# EAGLE design SwitchBox (EAGLE 5.10)
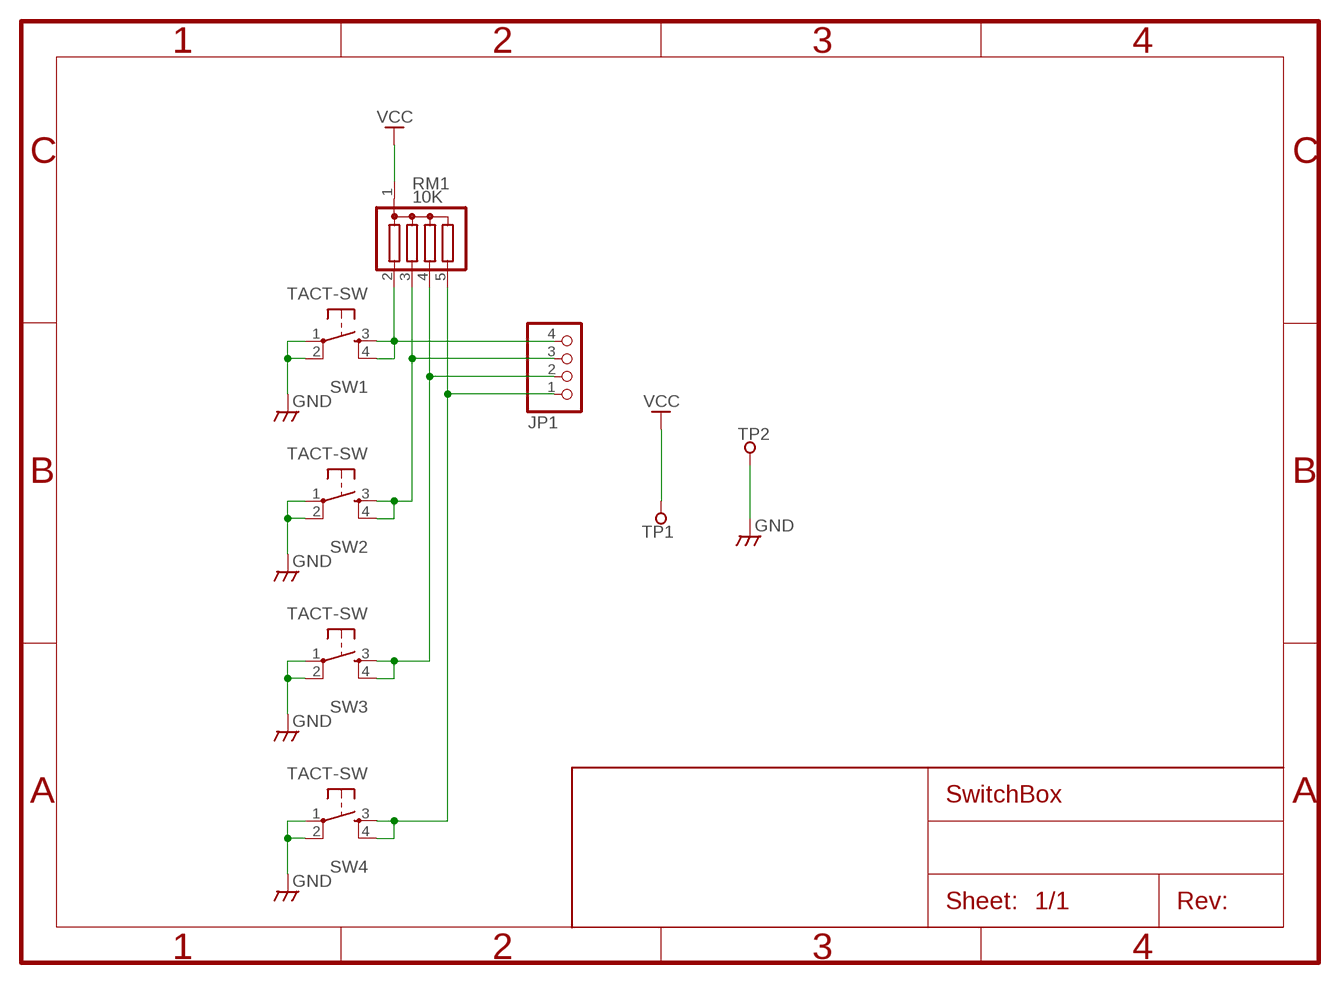
[diagram p0: schematic, sheet 1]

## Parts
JP1  PINHD-1X04_2.54-90°  [1X04/90]
RM1  10K  RM4  [SIL5]
SW1  TACT-SW  [B3F-10X]
SW2  TACT-SW  [B3F-10X]
SW3  TACT-SW  [B3F-10X]
SW4  TACT-SW  [B3F-10X]
TP1  TP1  [TP1]
TP2  TP1  [TP1]

## Nets
GND: SW1.1(P) SW1.2(P1) SW2.1(P) SW2.2(P1) SW3.1(P) SW3.2(P1) SW4.1(P) SW4.2(P1) TP2.P$1
N$1: JP1.4 RM1.2 SW1.3(S) SW1.4(S1)
N$2: JP1.3 RM1.3 SW2.3(S) SW2.4(S1)
N$3: JP1.1 RM1.5 SW4.3(S) SW4.4(S1)
N$4: JP1.2 RM1.4 SW3.3(S) SW3.4(S1)
VCC: RM1.1 TP1.P$1

## Library data of the parts
JP1 = pinheader:PINHD-1X04: PIN HEADER
RM1 = MyLib:RM4: 4 Element Register Array Module
SW1-SW4 = MyLib:TACT-SW: Tacticle Push Switch
TP1 TP2 = MyLib:TP1: 1 Pin Test Point

## Board
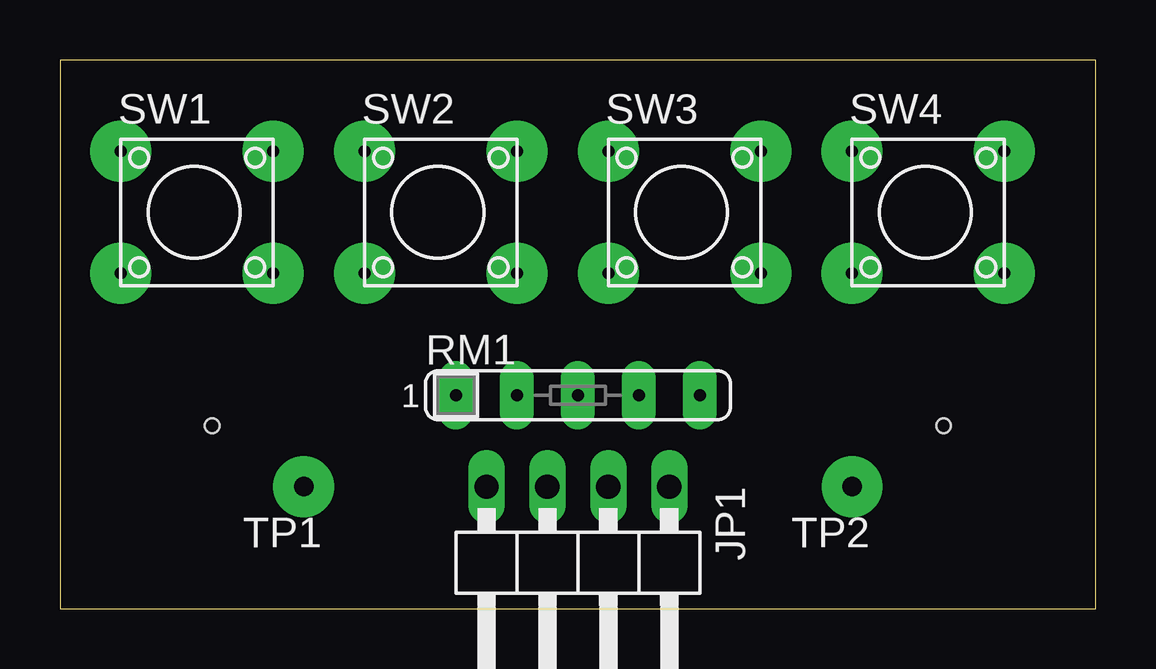
[diagram p1: board, top side]
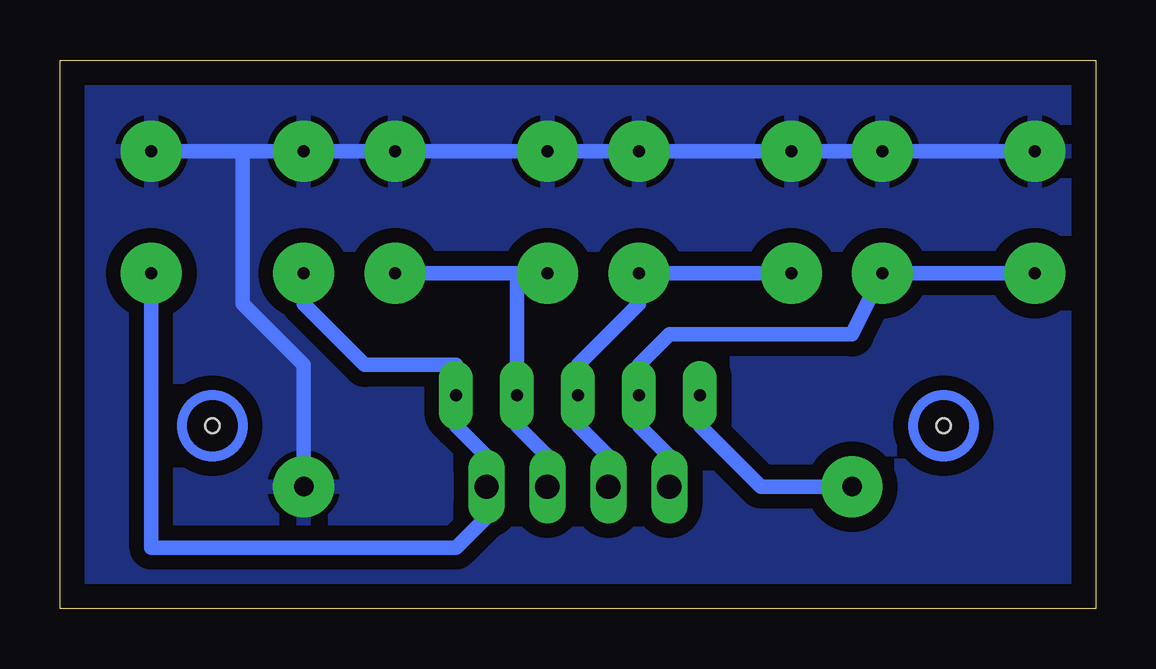
[diagram p2: board, bottom side, seen from below]

Size 43.18 x 22.86 mm. Coordinates in mm from the lower left corner, seen from the top.
Outline: 0,0 43.18,0 43.18,22.86 0,22.85 0,0
Copper layers (1*16): Top 0.035mm / dielectric 1.5mm / Bottom 0.035mm
Design rules "default": minimum track width 10mil, minimum drill 24mil, track to track 8mil, track to pad 8mil, pad to pad 8mil, via to via 8mil, smd to smd 8mil, copper to edge 40mil, drill to drill 8mil, minimum pad ring 10mil, minimum via ring 8mil, stop-mask expansion 4mil, vias tented up to drill 0mil, thermal gap 10mil
Holes 0.6 mm at 6.35,7.62 36.83,7.62

### Footprints (pad centres in the part's own frame; a part is rotated, then mirrored left to right if it is on the bottom)
1X04/90 = drill 1.016 long: 1 -3.81,-3.81; 2 -1.27,-3.81; 3 1.27,-3.81; 4 3.81,-3.81
SIL5 = drill 0.5 pad 1.422 long: 1 -5.08,0; 2 -2.54,0; 3 0,0; 4 2.54,0; 5 5.08,0
B3F-10X = drill 0.5 pad 2.54 round: 1 -1.27,2.54; 2 5.08,2.54; 3 -1.27,-2.54; 4 5.08,-2.54
TP1 = drill 0.813 pad 2.54 round: P$1 0,0

### Placement (x,y rotation side)
JP1  21.59,1.27 180 top
RM1  21.59,8.89 0 top
SW1  3.81,16.51 0 top
SW2  13.97,16.51 0 top
SW3  24.13,16.51 0 top
SW4  34.29,16.51 0 top
TP1  10.16,5.08 0 top
TP2  33.02,5.08 0 top

### Tracks (layer width: path | path; a pad name or v marks a point on that pad's centre or on a via)
GND
  Bottom 0.61: 35.56,19.05 SW4.1 SW3.2 SW2.2 | 35.56,19.05 SW4.2 | TP2.P$1 33.02,10.16 35.56,12.7 35.56,19.05 | SW1.1 SW1.2 SW2.1 SW2.2 | SW2.2 SW3.1
  pour Bottom (isolate 0.61): 0,22.86 0,0 43.18,0 43.18,22.86
N$1
  Bottom 0.61: SW1.3 SW1.4 10.16,11.43 16.51,11.43 17.78,11.43 19.05,10.16 RM1.2 19.05,7.62 17.78,6.35 JP1.4
N$2
  Bottom 0.61: JP1.3 20.32,6.35 21.59,7.62 RM1.3 21.59,10.16 19.05,12.7 SW2.4 SW2.3
N$3
  Bottom 0.61: SW4.4 39.37,2.54 26.67,2.54 25.4,3.81 JP1.1 25.4,6.35 26.67,7.62 RM1.5 26.67,10.16 30.48,10.16 33.02,12.7 SW4.3
N$4
  Bottom 0.61: 24.13,13.97 RM1.4 24.13,7.62 22.86,6.35 JP1.2 | 24.13,13.97 SW3.3 | 24.13,13.97 SW3.4
VCC
  Bottom 0.61: TP1.P$1 13.97,5.08 16.51,7.62 RM1.1
(copper drawn outside any net)
  shapes: Bottom circle x2